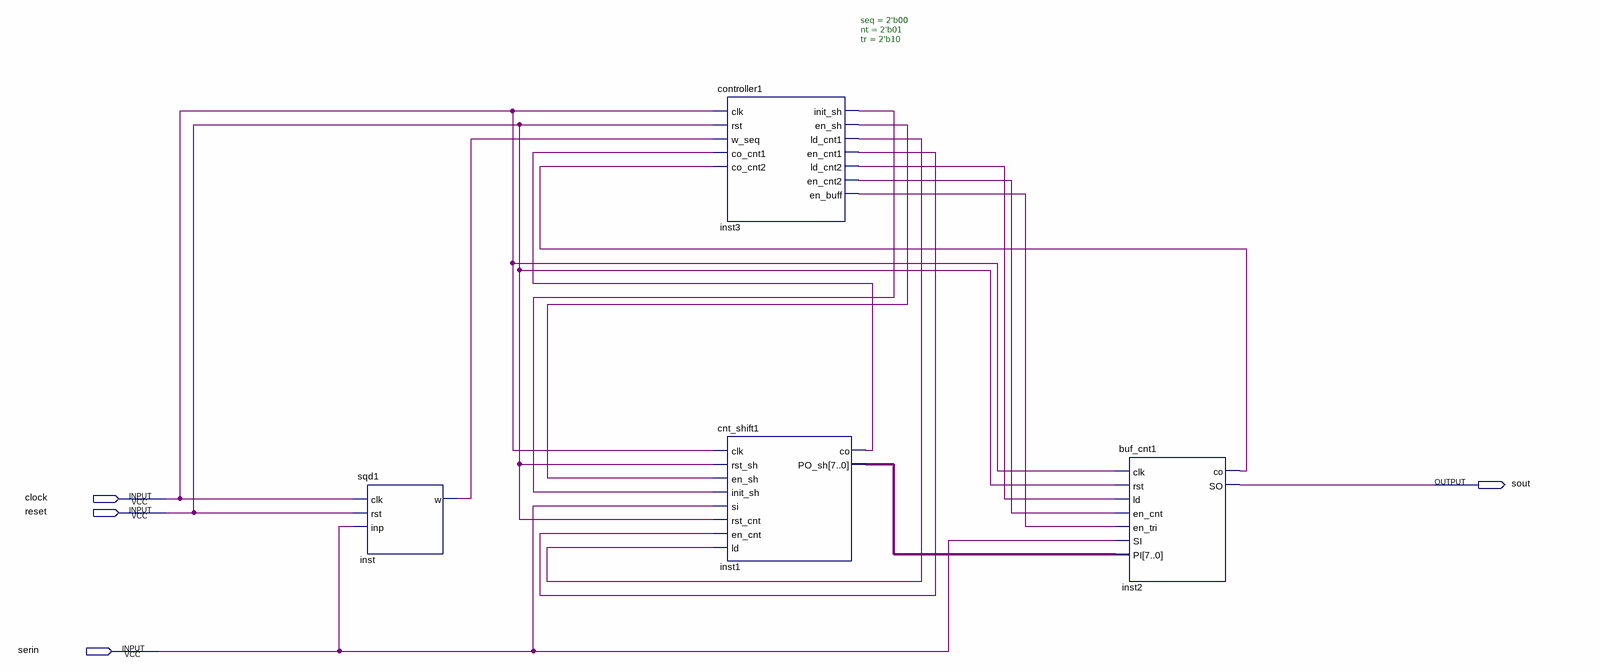
[diagram p0: schematic sheet]
// Quartus schematic ca5Q.bdf as structural Verilog: 4 symbols, 4 pins
module ca5Q (
  input  clock,
  input  reset,
  input  serin,
  output sout
);

  wire inst1_co, inst2_co, inst3_en_buff, inst3_en_cnt1, inst3_en_cnt2, inst3_en_sh, inst3_init_sh,
       inst3_ld_cnt1, inst3_ld_cnt2, inst_w;
  wire [7:0] inst1_po_sh;

  sqd1 inst (.clk(clock), .rst(reset), .inp(serin), .w(inst_w));
  controller1 #(.seq(2'b00), .nt(2'b01), .tr(2'b10)) inst3 (
    .clk(clock), .rst(reset), .w_seq(inst_w), .co_cnt1(inst1_co), .co_cnt2(inst2_co),
    .init_sh(inst3_init_sh), .en_sh(inst3_en_sh), .ld_cnt1(inst3_ld_cnt1), .en_cnt1(inst3_en_cnt1),
    .ld_cnt2(inst3_ld_cnt2), .en_cnt2(inst3_en_cnt2), .en_buff(inst3_en_buff));
  cnt_shift1 inst1 (
    .clk(clock), .rst_sh(reset), .en_sh(inst3_en_sh), .init_sh(inst3_init_sh), .si(serin), .rst_cnt(reset),
    .en_cnt(inst3_en_cnt1), .ld(inst3_ld_cnt1), .co(inst1_co), .PO_sh(inst1_po_sh));
  buf_cnt1 inst2 (
    .clk(clock), .rst(reset), .ld(inst3_ld_cnt2), .en_cnt(inst3_en_cnt2), .en_tri(inst3_en_buff), .SI(serin),
    .PI(inst1_po_sh), .co(inst2_co), .SO(sout));
endmodule
